# EAGLE design Switch-12v-PWM-4Ch (EAGLE 7.7.0)
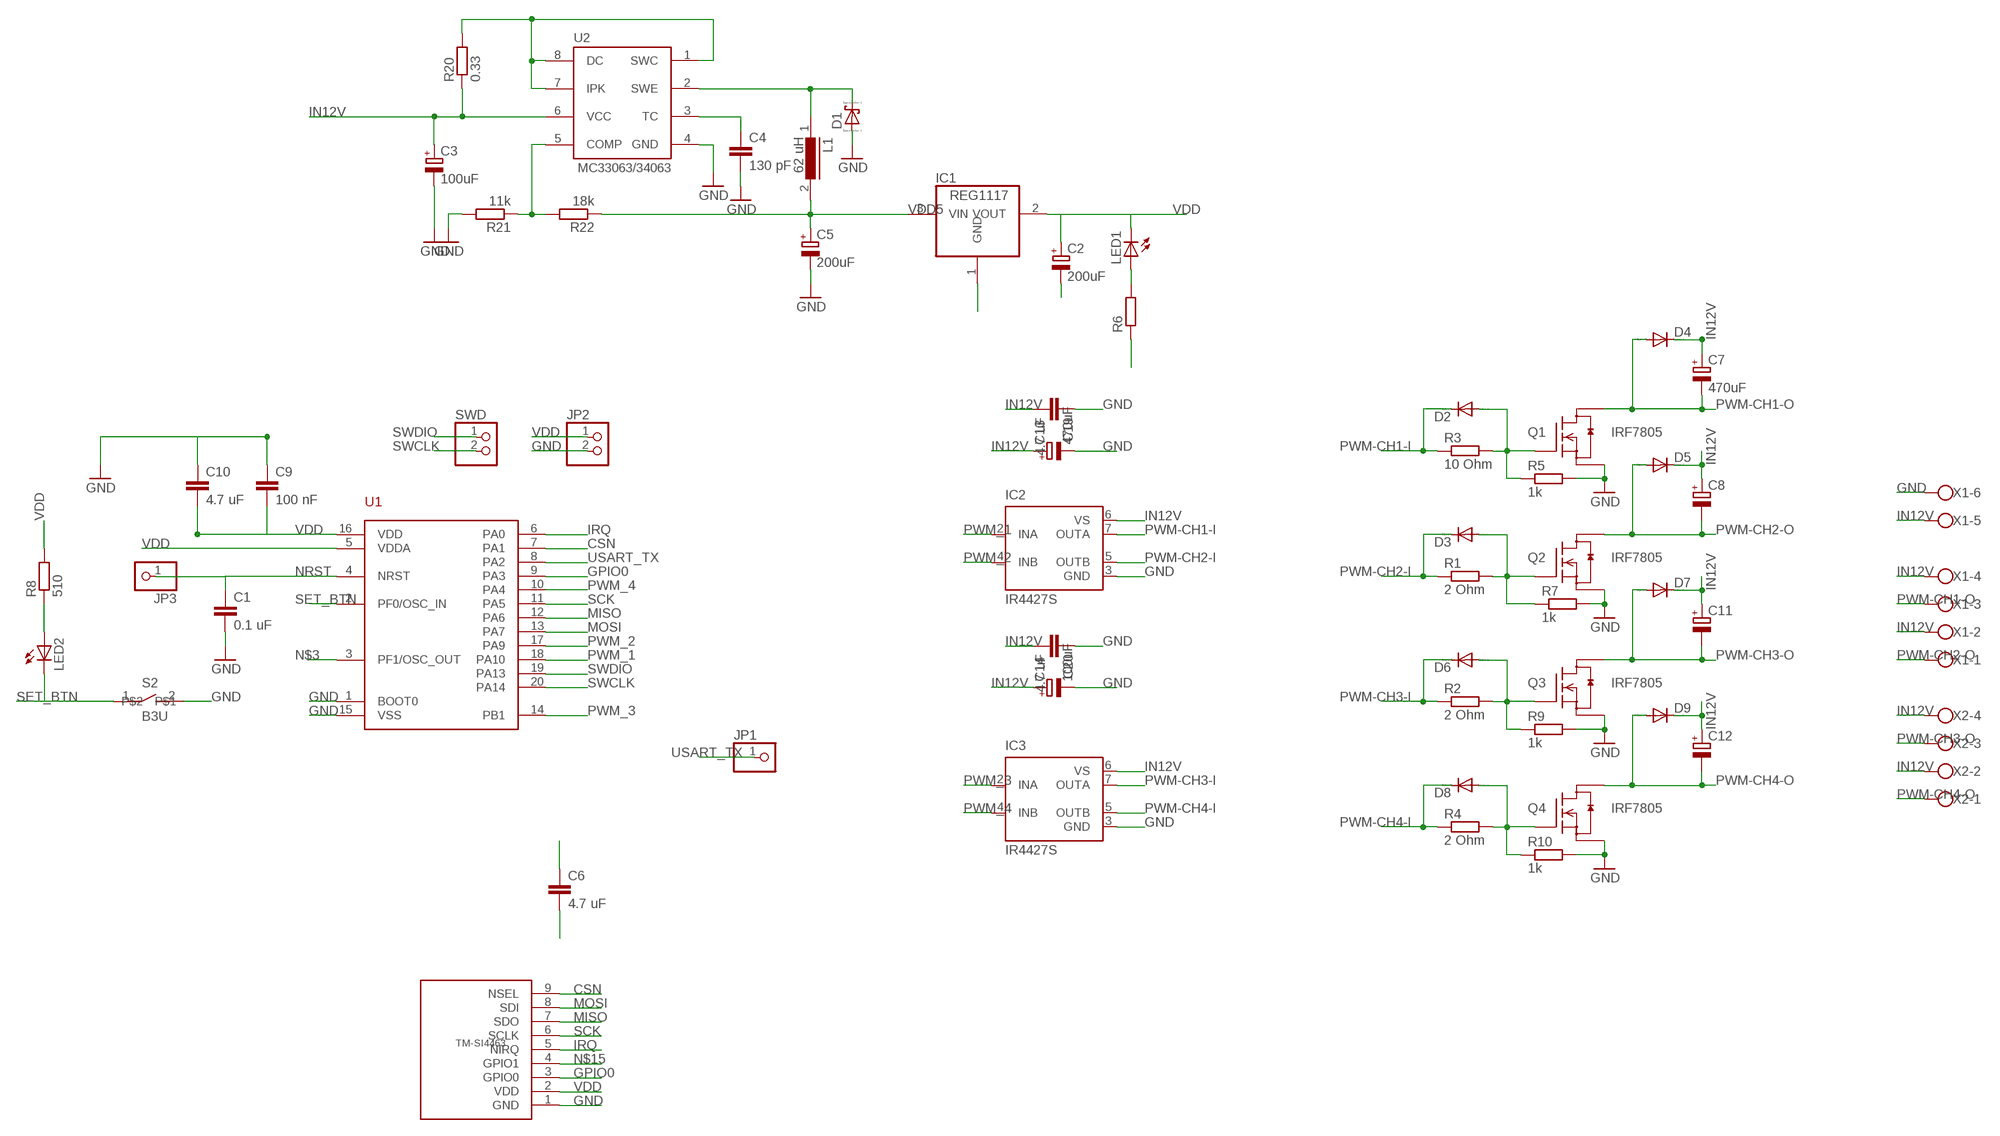
[diagram p0: schematic, sheet 1]

## Parts
C1  0.1 uF  C-EUC0805  [C0805]
C2  200uF  CPOL-EUSMCC  [SMC_C]
C3  100uF  CPOL-EUSMCC  [SMC_C]
C4  130 pF  C-EUC0805  [C0805]
C5  200uF  CPOL-EUSMCC  [SMC_C]
C6  4.7 uF  C-EUC0805  [C0805]
C7  470uF  CPOL-EUE5-8.5  [E5-8,5]
C8  CPOL-EUE5-8.5  [E5-8,5]
C9  100 nF  C-EUC0805  [C0805]
C10  4.7 uF  C-EUC0805  [C0805]
C11  CPOL-EUE5-8.5  [E5-8,5]
C12  CPOL-EUE5-8.5  [E5-8,5]
C13  470uF  CPOL-EU085CS-1AR  [085CS_1AR]
C14  100uF  CPOL-EU085CS-1AR  [085CS_1AR]
C19  4.7 uF  C-EUC0805  [C0805]
C20  4.7 uF  C-EUC0805  [C0805]
D1  SCHOTTKY-DIODE  [DIODE_SMB]
D2  DIODE-DO214BA  [DO214BA]
D3  DIODE-DO214BA  [DO214BA]
D4  DIODE-DO214BA  [DO214BA]
D5  DIODE-DO214BA  [DO214BA]
D6  DIODE-DO214BA  [DO214BA]
D7  DIODE-DO214BA  [DO214BA]
D8  DIODE-DO214BA  [DO214BA]
D9  DIODE-DO214BA  [DO214BA]
IC1  REG1117  [SOT223]
IC2  IR4427S  [SO08]
IC3  IR4427S  [SO08]
JP1  PINHD-1X1  [1X01]
JP2  PINHD-1X2  [1X02]
JP3  PINHD-1X1  [1X01]
L1  62 uH  DR73  [DR73]
LED1  LEDCHIPLED_0805  [CHIPLED_0805]
LED2  LEDCHIPLED_0805  [CHIPLED_0805]
Q1  IRF7805  [SO-8]
Q2  IRF7805  [SO-8]
Q3  IRF7805  [SO-8]
Q4  IRF7805  [SO-8]
R1  2 Ohm  R-EU_R0805  [R0805]
R2  2 Ohm  R-EU_R0805  [R0805]
R3  10 Ohm  R-EU_R0805  [R0805]
R4  2 Ohm  R-EU_R0805  [R0805]
R5  1k  R-EU_R0805  [R0805]
R6  R-EU_R0805  [R0805]
R7  1k  R-EU_R0805  [R0805]
R8  510  R-EU_R0805  [R0805]
R9  1k  R-EU_R0805  [R0805]
R10  1k  R-EU_R0805  [R0805]
R20  0.33  R-EU_R0805  [R0805]
R21  11k  R-EU_R0805  [R0805]
R22  18k  R-EU_R0805  [R0805]
S2  B3U  [1210]
SWD  PINHD-1X2  [1X02]
U1  STM32F030F4  [TSSOP20]
U2  MC33063/MC34063D  [SO08]
U$1  TM-SI4463  [TM-SI4463-SMD]
X1  W237-6  [W237-6]
X2  W237-4  [W237-4]

## Nets
CSN: U1.7(PA1) U$1.9(NSEL)
GND: C1.2 C2.- C3.- C4.2 C5.- C6.2 C9.1 C10.1 C13.- C14.- C19.1 C20.1 D1.A(C) IC1.1(GND) IC2.3(GND) IC3.3(GND) JP2.2 Q1.3(S) Q2.3(S) Q3.3(S) Q4.3(S) R5.2 R6.1 R7.2 R9.2 R10.2 R21.2 S2.2 U1.1(BOOT0) U1.15(VSS) U2.4(GND) U$1.1(GND) X1.6
GPIO0: U1.9(PA3) U$1.3(GPIO0)
IN12V: C3.+ C7.+ C8.+ C11.+ C12.+ C13.+ C14.+ C19.2 C20.2 D4.C D5.C D7.C D9.C IC2.6(VS) IC3.6(VS) R20.1 U2.6(VCC) X1.2 X1.4 X1.5 X2.2 X2.4
IRQ: U1.6(PA0) U$1.5(NIRQ)
MISO: U1.12(PA6) U$1.7(SDO)
MOSI: U1.13(PA7) U$1.8(SDI)
N$3: U1.3(PF1/OSC_OUT)
N$4: D2.A Q1.4(G) R3.2 R5.1
N$5: D3.A Q2.4(G) R1.2 R7.1
N$6: LED1.A R6.2
N$7: LED2.A R8.1
N$9: R21.1 R22.2 U2.5(COMP)
N$11: R20.2 U2.1(SWC) U2.7(IPK) U2.8(DC)
N$15: U$1.4(GPIO1)
N$18: C4.1 U2.3(TC)
N$19: D1.C(A) L1.1 U2.2(SWE)
N$26: D6.A Q3.4(G) R2.2 R9.1
N$29: D8.A Q4.4(G) R4.2 R10.1
NRST: C1.1 JP3.1 U1.4(NRST)
PWM-CH1-I: D2.C IC2.7(OUTA) R3.1
PWM-CH1-O: C7.- D4.A Q1.8(D) X1.3
PWM-CH2-I: D3.C IC2.5(OUTB) R1.1
PWM-CH2-O: C8.- D5.A Q2.8(D) X1.1
PWM-CH3-I: D6.C IC3.7(OUTA) R2.1
PWM-CH3-O: C11.- D7.A Q3.8(D) X2.3
PWM-CH4-I: D8.C IC3.5(OUTB) R4.1
PWM-CH4-O: C12.- D9.A Q4.8(D) X2.1
PWM_1: IC2.2(INA) U1.18(PA10)
PWM_2: IC2.4(INB) U1.17(PA9)
PWM_3: IC3.2(INA) U1.14(PB1)
PWM_4: IC3.4(INB) U1.10(PA4)
SCK: U1.11(PA5) U$1.6(SCLK)
SET_BTN: LED2.C S2.1 U1.2(PF0/OSC_IN)
SWCLK: SWD.2 U1.20(PA14)
SWDIO: SWD.1 U1.19(PA13)
USART_TX: JP1.1 U1.8(PA2)
VDD: C2.+ C6.1 C9.2 C10.2 IC1.2(VOUT) JP2.1 LED1.C R8.2 U1.5(VDDA) U1.16(VDD) U$1.2(VDD)
VDD5: C5.+ IC1.3(VIN) L1.2 R22.1
Unconnected: Q1.1(S) Q1.2(S) Q1.5(D) Q1.6(D) Q1.7(D) Q2.1(S) Q2.2(S) Q2.5(D) Q2.6(D) Q2.7(D) Q3.1(S) Q3.2(S) Q3.5(D) Q3.6(D) Q3.7(D) Q4.1(S) Q4.2(S) Q4.5(D) Q4.6(D) Q4.7(D)

## Library data of the parts
C1 C4 C6 C9 C10 C19 C20 = resistor:C-EU: CAPACITOR, European symbol
C2 C3 C5 C7 C8 C11-C14 = resistor:CPOL-EU: POLARIZED CAPACITOR, European symbol
D1 = eagle-ltspice:SCHOTTKY-DIODE: Schottky Diode; SPICEMODEL: NONE; SPICEPREFIX: D; SPICETYPE: diode
D2-D9 = diode:DIODE-: DIODE
IC1 = burr-brown:REG1117: 800mA and 1A Low Dropout (LDO) Positive Regulator 1.8V, 2.5V, 2.85V, 3.3V, 5V, and Adj; MPN: REG1117; OC_FARNELL: 1097566; OC_NEWARK: 14P6981
IC2 IC3 = ir:IR4427: DUAL LOW SIDE DRIVER Source: ID4426.pdf; MF: INTERNATIONAL RECTIFIER(IR); MPN: IR4427STRPBF; OC_FARNELL: 8639094; OC_NEWARK: 63J7933
JP1 JP3 = pinhead:PINHD-1X1: PIN HEADER
JP2 SWD = pinhead:PINHD-1X2: PIN HEADER
L1 = inductors:DR73: High Power Density, High Efficiency, Shielded Inductors Source: coiltronics_dr_series.pdf
LED1 LED2 = led:LED: LED OSRAM: - CHIPLED LG R971, LG N971, LY N971, LG Q971, LY Q971, LO R971, LY R971 LH N974, LH R974 LS Q976, LO Q976, LY Q976 LO Q996 - Hyper CHIPLED LW Q18S LB Q993, LB Q99A, LB R99A - SideLED LS A670, LO A670, LY A670, LG A670, LP A670 LB A673, LV A673, LT A673, LW A673 LH A674 LY A675 LS A676, LA A676, LO A676, LY A676, LW A676 LS A679, LY A679, LG A679 - Hyper Micro SIDELED® LS Y876, LA Y876, LO Y876, LY Y876 LT Y87S - SmartLED LW L88C, LW L88S LB L89C, LB L89S, LG L890 LS L89K, LO L89K, LY L89K LS L896, LA L896, LO L896, LY L896 - TOPLED LS T670, LO T670, LY T670, LG T670, LP T670 LSG T670, LSP T670, LSY T670, LOP T670, LYG T670 LG T671, LOG T671, LSG T671 LB T673, LV T673, LT T673, LW T673 LH T674 LS T676, LA T676, LO T676, LY T676, LB T676, LH T676, LSB T676, LW T676 LB T67C, LV T67C, LT T67C, LS T67K, LO T67K, LY T67K, LW E67C LS E67B, LA E67B, LO E67B, LY E67B, LB E67C, LV E67C, LT E67C LW T67C LS T679, LY T679, LG T679 LS T770, LO T770, LY T770, LG T770, LP T770 LB T773, LV T773, LT T773, LW T773 LH T774 LS E675, LA E675, LY E675, LS T675 LS T776, LA T776, LO T776, LY T776, LB T776 LHGB T686 LT T68C, LB T68C - Hyper Mini TOPLED® LB M676 - Mini TOPLED Santana® LG M470 LS M47K, LO M47K, LY M47K Source: http://www.osram.convergy.de LUXEON: - LUMILED® LXK2-PW12-R00, LXK2-PW12-S00, LXK2-PW14-U00, LXK2-PW14-V00 LXK2-PM12-R00, LXK2-PM12-S00, LXK2-PM14-U00 LXK2-PE12-Q00, LXK2-PE12-R00, LXK2-PE12-S00, LXK2-PE14-T00, LXK2-PE14-U00 LXK2-PB12-K00, LXK2-PB12-L00, LXK2-PB12-M00, LXK2-PB14-N00, LXK2-PB14-P00, LXK2-PB14-Q00 LXK2-PR12-L00, LXK2-PR12-M00, LXK2-PR14-Q00, LXK2-PR14-R00 LXK2-PD12-Q00, LXK2-PD12-R00, LXK2-PD12-S00 LXK2-PH12-R00, LXK2-PH12-S00 LXK2-PL12-P00, LXK2-PL12-Q00, LXK2-PL12-R00 Source: www.luxeon.com KINGBRIGHT: KA-3528ASYC Source: www.kingbright.com
Q1-Q4 = m-pad-2.1:IRF7805: Internation Rectifier's IRF7805 HEXFET® Chip-Set for DC-DC Converters Description: This new device employs advanced HEXFET Power MOSFET technology to achieve an unprecedented balance of on-resistance and gate charge. The reduced conduction and switching losses make this device ideal for high efficiency DC-DC Converters that power the latest generation of mobile microprocessors. The IRF7805 offers maximum efficiency for mobile CPU core DC-DC converters. N Channel Application Specific MOSFETs Ideal for Mobile DC-DC Converters Low Conduction Losses Low Switching Losses VDS = 30V RDS(on) = 11mOhm Qg = 31nC Please send any comments to: messi@users.sourceforge.net
R1-R10 R20-R22 = resistor:R-EU_: RESISTOR, European symbol
S2 = my_components:B3U
U1 = stm32f030f4:STM32F030F4
U2 = adafruit:MC33063/MC34063: MC33063 and MC34063 Basic DC/DC converter with internal power-NPN transistor, 100KHz, 1.5A peak switch current. 3-40 input/output.
U$1 = RemoteSwitchComponents:TM-SI4463
X1 = con-wago-500:W237-6: WAGO SCREW CLAMP; OC_FARNELL: unknown; OC_NEWARK: unknown
X2 = con-wago-500:W237-4: WAGO SCREW CLAMP; OC_FARNELL: unknown; OC_NEWARK: unknown

## Board
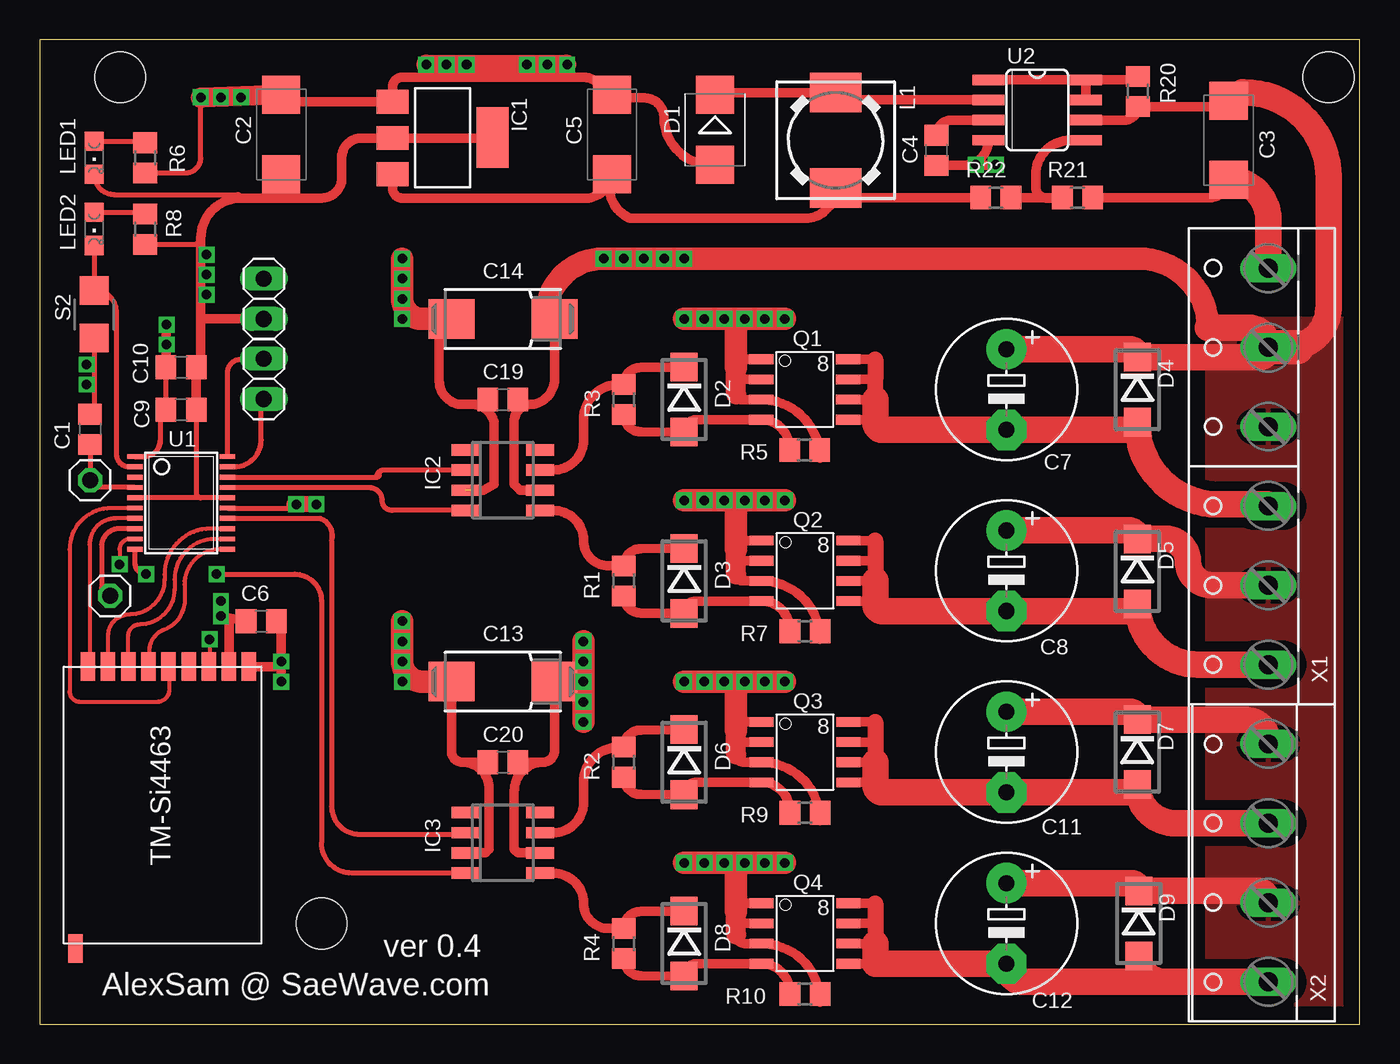
[diagram p1: board, top side]
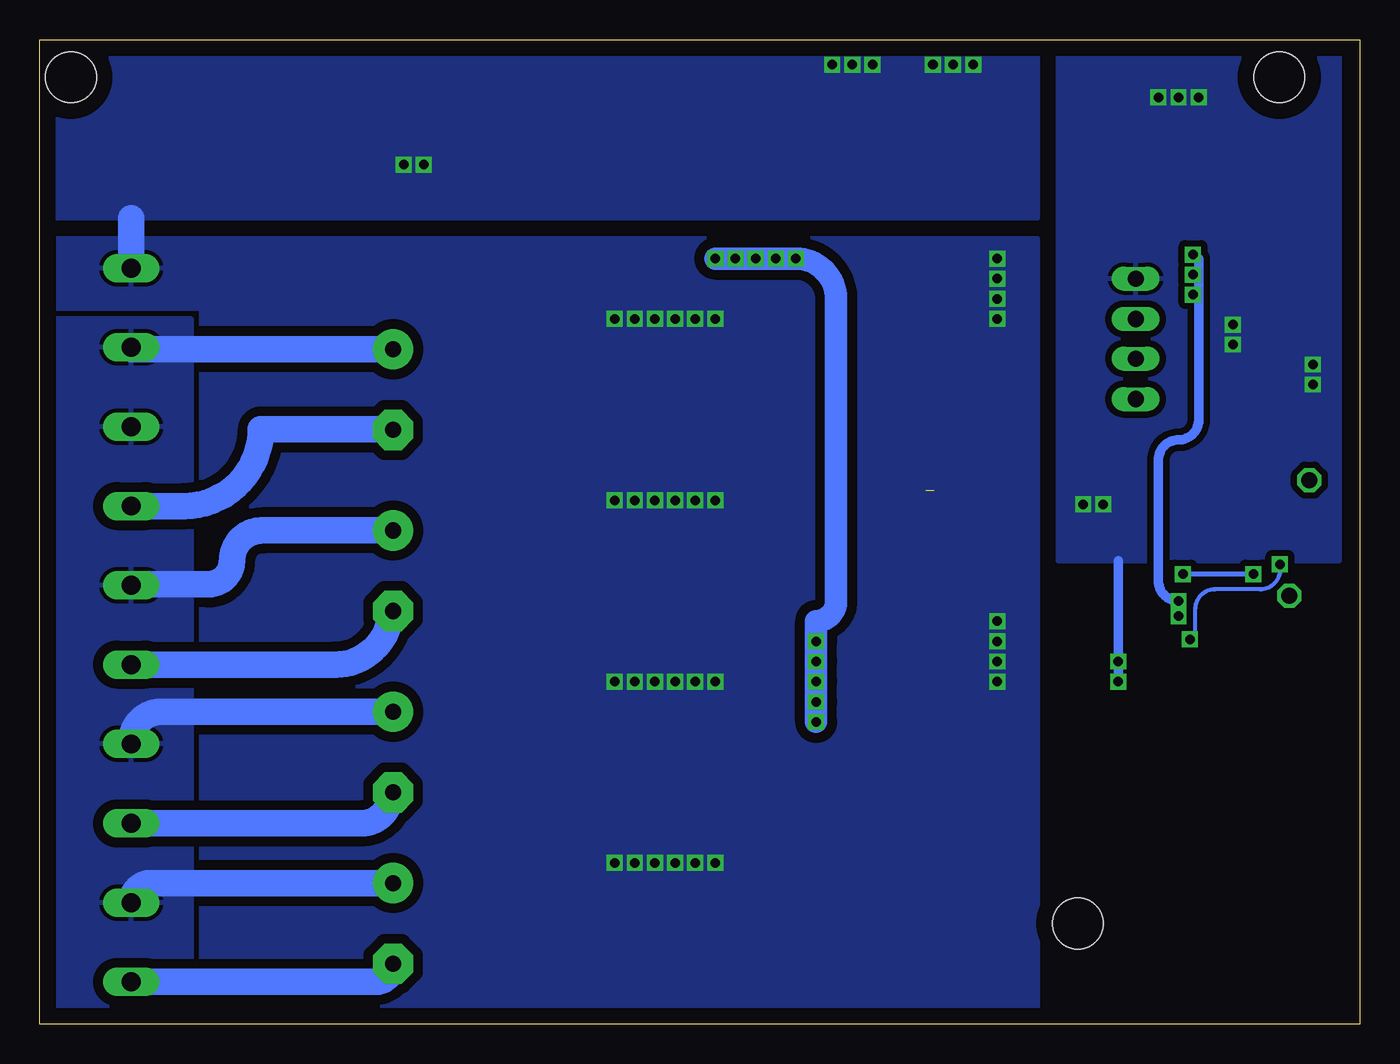
[diagram p2: board, bottom side, seen from below]

Size 83.25 x 62.05 mm. Coordinates in mm from the lower left corner, seen from the top.
Outline: 0,0 83.25,0 83.25,62.05 0,62.05 0,0
Copper layers (1*16): Top 0.035mm / dielectric 1.5mm / Bottom 0.035mm
Design rules "default *": minimum track width 10mil, minimum drill 12mil, track to track 8mil, track to pad 8mil, pad to pad 8mil, via to via 8mil, smd to smd 8mil, copper to edge 40mil, drill to drill 6mil, minimum pad ring 10mil, minimum via ring 8mil, stop-mask expansion 4mil, vias tented up to drill 24mil, thermal gap 10mil
Holes 3.2 mm at 5.08,59.69 81.28,59.69 17.78,6.35

### Footprints (pad centres in the part's own frame; a part is rotated, then mirrored left to right if it is on the bottom)
C0805 = smd 1.3 x 1.5: 1 -0.95,0; 2 0.95,0
SMC_C = smd 2.4 x 2.4: + -2.5,0; - 2.5,0
E5-8,5 = drill 1.016 pad 2.54: + -2.54,0 | drill 1.016 pad 2.54 octagon: - 2.54,0
085CS_1AR = smd 2.9 x 2.5: + 3.25,0; - -3.25,0
DIODE_SMB = smd 2.4 x 2.4: A 2.2,0; C -2.2,0
DO214BA = smd 1.8 x 1.7: A 2.05,0; C -2.05,0
SOT223 = smd 1.499 x 2.007: 1 -2.261,-3.15; 2 0.025,-3.15; 3 2.311,-3.15 | smd 3.81 x 2.007: 4 0,3.15
SO08 = smd 0.72 x 1.78: 1 -1.905,-2.35; 2 -0.635,-2.35; 3 0.635,-2.35; 4 1.905,-2.35; 5 1.905,2.35; 6 0.635,2.35; 7 -0.635,2.35; 8 -1.905,2.35
1X01 = drill 1.016 octagon: 1 0,0
1X02 = drill 1.016 long: 1 -1.27,0; 2 1.27,0
DR73 = smd 2.5 x 3.25: 1 -3,0; 2 3,0
CHIPLED_0805 = smd 1.2 x 1.2: A 0,-1.05; C 0,1.05
SO-8 = smd 1.524 x 0.61: 1 -2.743,1.27; 2 -2.743,0; 3 -2.743,-1.27; 4 -2.743,-2.54; 5 2.743,-2.54; 6 2.743,-1.27; 7 2.743,0; 8 2.743,1.27
R0805 = smd 1.3 x 1.5: 1 -0.95,0; 2 0.95,0
1210 = smd 1.8 x 1.8: 1 -1.499,0; 2 1.499,0
TSSOP20 = smd 0.305 x 0.991: 1 -2.925,-2.918; 2 -2.275,-2.918; 3 -1.625,-2.918; 4 -0.975,-2.918; 5 -0.325,-2.918; 6 0.325,-2.918; 7 0.975,-2.918; 8 1.625,-2.918; 9 2.275,-2.918; 10 2.925,-2.918; 11 2.925,2.918; 12 2.275,2.918; 13 1.625,2.918; 14 0.975,2.918; 15 0.325,2.918; 16 -0.325,2.918; 17 -0.975,2.918; 18 -1.625,2.918; 19 -2.275,2.918; 20 -2.925,2.918
SO08' = smd 0.66 x 2.032: 1 -1.905,-3.073; 2 -0.635,-3.073; 3 0.635,-3.073; 4 1.905,-3.073; 5 1.905,3.073; 6 0.635,3.073; 7 -0.635,3.073; 8 -1.905,3.073
TM-SI4463-SMD = smd 1.778 x 0.914: 1 8.572,-5.588; 2 8.572,-4.318; 3 8.572,-3.048; 4 8.572,-1.778; 5 8.572,-0.508; 6 8.572,0.762; 7 8.572,2.032; 8 8.572,3.302; 9 8.572,4.572; 10 -9.207,5.366
W237-6 = drill 1.194 long: 1 -12.5,-1.27; 2 -7.5,-1.27; 3 -2.5,-1.27; 4 2.5,-1.27; 5 7.5,-1.27; 6 12.5,-1.27
W237-4 = drill 1.194 long: 1 -7.5,-1.27; 2 -2.5,-1.27; 3 2.5,-1.27; 4 7.5,-1.27

### Placement (x,y rotation side)
C1  3.17,37.49 90 top
C2  15.24,56.08 90 top
C3  74.97,55.72 270 top
C4  56.55,55.08 270 top
C5  36.09,56.08 90 top
C6  13.97,25.4 0 top
C7  60.96,40 270 top
C8  60.96,28.58 270 top
C9  8.93,38.73 0 top
C10  8.93,41.41 0 top
C11  60.96,17.15 270 top
C12  60.96,6.35 270 top
C13  29.21,21.59 0 top
C14  29.21,44.45 0 top
C19  29.21,39.37 0 top
C20  29.21,16.51 0 top
D1  42.59,56.38 270 top
D2  40.64,39.37 270 top
D3  40.64,27.94 270 top
D4  69.22,39.99 270 top
D5  69.22,28.54 270 top
D6  40.64,16.51 270 top
D7  69.21,17.14 270 top
D8  40.64,5.08 270 top
D9  69.3,6.35 270 top
IC1  25.4,55.88 270 top
IC2  29.21,34.29 270 top
IC3  29.21,11.43 270 top
JP1  4.44,27 0 top
JP2  14.13,45.72 90 top
JP3  3.18,34.29 0 top
L1  50.19,55.72 270 top
LED1  3.44,54.61 180 top
LED2  3.44,50.13 180 top
Q1  48.24,40.64 0 top
Q2  48.26,29.21 0 top
Q3  48.26,17.78 0 top
Q4  48.26,6.35 0 top
R1  36.83,27.94 270 top
R2  36.83,16.51 270 top
R3  36.83,39.37 270 top
R4  36.83,5.08 270 top
R5  48.24,36.19 0 top
R6  6.66,54.61 90 top
R7  48.26,24.76 0 top
R8  6.66,50.1 270 top
R9  48.26,13.33 0 top
R10  48.26,1.9 0 top
R20  69.25,58.79 90 top
R21  65.44,52.1 0 top
R22  60.29,52.1 0 top
S2  3.44,44.76 270 top
SWD  14.13,40.67 90 top
U1  8.93,32.85 270 top
U2  MC33063/MC34063D  [SO08']  62.9,57.62 270 top
U$1  7.62,13.97 90 top
X1  76.2,35.16 90 top
X2  76.2,10.16 90 top

### Tracks (layer width: path | path; a pad name or v marks a point on that pad's centre or on a via)
CSN
  Top 0.254: U1.7 4.79,31.88 arc90 3.15,30.24 3.15,22.64 arc-90 U$1.9
GND  (via drill 0.6)  (1 unrouted)
  Top 0.305: U1.1 6.57,35.78 arc90 7.62,36.83 7.62,38.38 arc-90 C9.1 C10.1 | S2.2 3.44,41.91 | 3.44,41.91 3.44,40.64 | 3.44,40.64 3.44,38.71 arc-90 C1.2 | v2.96,41.58 3.11,41.58 arc90 3.44,41.91 | v2.96,40.32 3.12,40.32 arc90 3.44,40.64 | U1.15 17.22,32.53 arc90 v17.45,32.76 | R6.1 9.21,53.66 arc90 10.16,54.61 v10.16,58.42
  Top 0.61: 43.91,5.66 arc90 44.49,5.08 Q4.3 arc-90 49.21,1.39 R10.2 | 43.91,7.08 arc-90 44.45,7.62 45.72,7.62 | 43.91,6.35 45.72,6.35 | 43.91,17 arc90 44.4,16.51 Q3.3 arc-90 49.21,12.82 R9.2 | 43.91,18.51 arc-90 44.45,19.05 45.72,19.05 | 43.91,28.34 arc90 44.31,27.94 Q2.3 arc-90 49.21,24.25 R7.2 | 43.91,29.94 arc-90 44.45,30.48 45.72,30.48 | 43.91,29.21 45.72,29.21 | 43.91,17.78 45.72,17.78 | 43.91,41.37 arc-90 44.45,41.91 45.72,41.91 | 45.72,40.64 43.91,40.64 43.91,39.68 arc90 44.22,39.37 Q1.3 arc-90 49.19,35.68 R5.2 | U2.4 arc-90 58.24,54.13 C4.2 60.24,54.13 arc90 v60.29,54.18 | R21.2 73.65,52.1 arc90 C3.- | D1.A 42.34,54.18 arc-90 39.37,57.15 arc90 38.14,58.38 35.56,58.38 | 35.56,58.38 C5.- | 33.02,59.69 22.86,59.69 arc90 22.25,59.08 IC1.1 15.48,58.14 arc-90 C2.- | 33.02,59.69 34.29,59.69 arc-90 35.56,58.42 35.56,58.38 | C6.2 arc-90 15.24,25.08 v15.24,22.86 | v15.24,22.86 v15.24,21.59 | C10.1 7.97,44.08 arc-90 v8,44.1 | v33.27,60.48 33.02,59.69 | 27.09,39.06 arc-90 28.66,37.8 28.66,34.02 27.98,33.66 27.36,33.66 | 27.09,39.06 26.67,39.06 | 26.67,39.06 26.46,39.06 | 25.4,44.45 arc90 25.2,44.25 25.2,40.53 arc90 26.67,39.06 | C19.1 27.95,39.06 27.09,39.06 | IC3.3 28.11,10.79 28.35,11.04 28.35,14.83 arc90 26.67,16.51 | C20.1 26.67,16.51 | C13.- 25.96,17.22 arc90 26.67,16.51 | U$1.1 14.92,22.54 arc90 v15.24,22.86
  Top 1.016: v17.45,32.76 16.07,32.76
  Top 1.27: 43.91,7.08 43.91,6.35 43.91,5.66 | 43.91,18.51 43.91,17.78 43.91,17 | 43.91,29.94 43.91,29.21 43.91,28.34 | 43.91,39.68 43.91,41.37 | C2.- 10.2,58.38 arc-90 v10.16,58.42 | v24.38,60.48 33.2,60.48
  Top 1.422: 43.91,7.08 43.91,10.16 | 43.91,10.16 v43.18,10.16 v41.91,10.16 v40.64,10.16 | 43.91,10.16 v44.45,10.16 v45.72,10.16 v46.99,10.16 | 43.91,29.94 43.91,33.02 | 43.91,33.02 v43.18,33.02 v41.91,33.02 v40.64,33.02 | 43.91,33.02 v44.45,33.02 v45.72,33.02 v46.99,33.02 | 43.91,18.51 43.91,21.59 | 43.91,21.59 v43.18,21.59 v41.91,21.59 v40.64,21.59 | 43.91,21.59 v44.45,21.59 v45.72,21.59 v46.99,21.59 | 43.91,41.37 43.91,44.45 | 43.91,44.45 v43.18,44.45 v41.91,44.45 v40.64,44.45 | 43.91,44.45 v44.45,44.45 v45.72,44.45 v46.99,44.45 | C14.- 25.4,44.45 24.13,44.45 arc-90 v22.86,45.72 v22.86,46.99 v22.86,48.26 | C13.- 24.13,21.59 arc-90 v22.86,22.86 v22.86,24.13 v22.86,25.4
  Top 1.676: X1.6 77.47,50.77 arc90 C3.-
  Bottom 0.61: v15.24,21.59 15.24,29.21
  Bottom 1.676: X1.6 77.47,50.8
  other vias: 22.86,44.45 59.03,54.18 22.86,21.59 11.43,58.42 12.7,58.42 25.65,60.48 26.92,60.48 32,60.48 30.73,60.48 8,42.84 16.18,32.76
  pour Bottom (isolate 0.61): 82.55,49.53 20.32,49.53 20.32,0 73.03,0 73.03,45.08 82.55,45.08
  pour Bottom (isolate 0.406): 19.05,63.5 19.05,29.21 1.27,29.21 1.27,63.5
  pour Bottom (isolate 0.406): 20.32,50.8 83.82,50.8 83.82,62.23 20.32,62.23
GPIO0  (via drill 0.6)
  Top 0.254: U1.9 5.7,30.58 arc90 5.04,29.93 v5.04,28.98 | v10.71,24.25 10.71,22.58 arc-90 U$1.3
  Bottom 0.254: v5.04,28.98 5.04,28.66 arc90 6.3,27.41 9.13,27.41 arc-90 10.39,26.14 10.39,24.57 arc90 v10.71,24.25
IN12V  (via drill 0.6)
  Top 0.61: C3.+ arc-90 73.99,57.84 R20.1 arc-90 68.39,56.98 U2.6 | 30.87,39.06 arc90 29.93,37.8 29.93,34.02 30.29,33.66 IC2.6 | C14.+ 32.46,40.65 arc-90 30.87,39.06 | C19.2 30.47,39.06 30.87,39.06 | IC3.6 30.16,10.79 29.93,11.04 29.93,14.69 arc-90 31.75,16.51 | C20.2 31.75,16.51 | C13.+ 32.46,17.22 arc-90 31.75,16.51
  Top 1.422: 73.66,43.89 arc90 69.29,48.26 v40.64,48.26 v39.37,48.26 v38.1,48.26 v36.83,48.26 v35.56,48.26 arc90 31.91,44.61 C14.+ | C13.+ v34.29,21.59 | v34.29,21.59 v34.29,22.86 v34.29,24.13 | v34.29,21.59 v34.29,20.32 v34.29,19.05
  Top 1.676: 73.66,43.89 76.24,43.89 arc-90 X1.5 arc-90 76.85,42.04 D4.C arc90 68.72,42.54 C7.+ | C3.+ 75.88,58.74 arc-90 81.28,53.34 81.28,45.2 arc-90 78.74,42.66 | X2.2 arc90 76.73,8.4 D9.C arc90 68.81,8.89 C12.+ | C11.+ 68.72,19.69 arc-90 D7.C 75.94,19.2 arc-90 X2.4 | X1.2 73.94,27.66 arc-90 72.39,29.21 arc90 71.01,30.59 D5.C arc90 68.69,31.12 C8.+
  Top 2.184: X1.5 78.74,42.66 79.26,42.66
  Bottom 1.422: v40.64,48.26 v39.37,48.26 v38.1,48.26 v36.83,48.26 v35.56,48.26 arc90 33.02,45.72 33.02,26.67 arc90 34.29,25.4 v34.29,24.13 v34.29,22.86 v34.29,21.59 v34.29,20.32 v34.29,19.05
  Bottom 1.676: C7.+ 77.35,42.54 arc90 X1.5 | C8.+ 69.21,31.12 arc-90 71.12,29.21 arc90 72.61,27.72 77.49,27.72 | C11.+ 75.56,19.69 arc-90 77.47,17.78 | C12.+ 76.2,8.89 arc-90 77.47,7.62
  pour Bottom (isolate 0.61): 73.66,44.45 82.55,44.45 82.55,0 73.66,0
  pour Top (isolate 0.61): 73.66,44.45 82.55,44.45 82.55,1.27 73.66,1.27
IRQ
  Top 0.254: U1.6 4.5,32.53 arc90 1.89,29.93 1.89,20.97 arc90 2.54,20.32 7.41,20.32 arc90 8.19,21.11 8.19,22.48 arc90 U$1.5
MISO
  Top 0.254: U1.12 11.05,30.58 arc90 8.51,28.04 8.51,27.41 arc-90 6.3,25.2 arc90 5.59,24.49 U$1.7
MOSI
  Top 0.254: U1.13 10.76,31.23 arc90 7.88,28.35 7.88,28.04 arc-90 5.67,25.83 arc90 4.32,24.48 U$1.8
N$4
  Top 0.61: R3.2 arc90 37.91,37.34 D2.A arc-90 41.4,38.1 Q1.4 arc-90 47.29,36.31 R5.1
N$5
  Top 0.61: R7.1 47.31,24.88 arc90 Q2.4 41.4,26.67 arc90 D3.A 37.91,25.91 arc-90 R1.2
N$6
  Top 0.305: LED1.A 6.56,55.66 arc-90 R6.2
N$7
  Top 0.305: LED2.A 6.54,51.18 arc-90 R8.1
N$9
  Top 0.61: R22.2 R21.1 arc-90 64.46,52.07 63.5,52.07 arc-90 62.81,52.76 62.81,53.55 arc-90 64.97,55.72 U2.5
N$11
  Top 0.61: U2.8 69.03,59.52 arc90 R20.2 | U2.7 U2.8 | U2.8 U2.1
N$18
  Top 0.61: U2.3 57.51,56.98 arc90 C4.1
N$19
  Top 0.61: U2.2 50.65,58.26 arc-90 L1.1 42.72,58.72 arc90 D1.C
N$26
  Top 0.61: R2.2 arc90 37.91,14.48 D6.A arc-90 41.4,15.24 Q3.4 arc-90 47.31,13.45 R9.1
N$29
  Top 0.61: R10.1 47.31,2.02 arc90 Q4.4 41.4,3.81 arc90 D8.A 37.91,3.06 arc-90 R4.2
NRST
  Top 0.305: U1.4 3.64,33.83 arc-90 JP3.1 arc-90 JP3.1 C1.1
PWM-CH1-I
  Top 0.61: D2.C 37.91,41.4 arc90 R3.1 36.51,40.32 arc90 34.29,38.1 34.29,36.83 arc-90 32.38,34.92 IC2.7
PWM-CH1-O
  Top 0.61: Q1.8 52.7,41.91 | 52.7,38.1 50.8,38.1 | 52.7,40.64 50.8,40.64 | 52.7,39.37 50.8,39.37
  Top 1.016: 52.7,38.1 52.7,39.37 52.7,40.64 52.7,41.91
  Top 1.676: 52.7,39.37 52.7,37.94 arc90 53.18,37.46 C7.- 68.74,37.46 arc90 D4.A 69.22,37.88 arc90 74.34,32.76 77.37,32.76 arc-90 X1.3
  Bottom 1.676: X1.3 74.12,32.66 arc-90 69.3,37.48 61.11,37.48
PWM-CH2-I
  Top 0.61: D3.C 37.91,29.96 arc90 R1.1 35.88,28.89 arc-90 34.29,30.48 arc90 32.38,32.38 IC2.5
PWM-CH2-O
  Top 0.61: Q2.8 52.7,30.48 | 52.7,26.67 50.8,26.67 | 52.7,29.21 50.8,29.21 | 52.7,27.94 50.8,27.94
  Top 1.016: 52.7,26.67 52.7,27.94 52.7,29.21 52.7,30.48
  Top 1.676: 52.7,27.94 52.7,26.49 arc90 53.15,26.04 C8.- 68.77,26.04 arc90 D5.A arc90 73.05,22.66 X1.1
  Bottom 1.676: X1.1 64.59,22.66 arc-90 61.11,26.14
PWM-CH3-I
  Top 0.61: D6.C 37.91,18.54 arc90 R2.1 36.51,17.46 arc90 34.29,15.24 34.29,13.97 arc-90 32.38,12.06 IC3.7
PWM-CH3-O
  Top 0.61: Q3.8 52.7,19.05 | 52.7,15.24 50.8,15.24 | 52.7,17.78 50.8,17.78 | 52.7,16.51 50.8,16.51
  Top 1.016: 52.7,15.24 52.7,16.51 52.7,17.78 52.7,19.05
  Top 1.676: 52.7,16.51 52.7,15.1 arc90 53.19,14.61 C11.- 68.72,14.61 arc90 D7.A arc90 71.64,12.66 X2.3
  Bottom 1.676: X2.3 62.94,12.66 arc-90 61.11,14.49
PWM-CH4-I
  Top 0.61: D8.C 37.91,7.11 arc90 R4.1 35.88,6.03 arc-90 34.29,7.62 arc90 32.38,9.53 IC3.5
PWM-CH4-O
  Top 0.61: Q4.8 52.7,7.62 | 52.7,3.81 50.8,3.81 | 52.7,6.35 50.8,6.35 | 52.7,5.08 50.8,5.08
  Top 1.016: 52.7,3.81 52.7,5.08 52.7,6.35 52.7,7.62
  Top 1.676: 52.7,4.3 52.7,5.08 | D9.A arc90 70.94,2.66 | 70.94,2.66 X2.1 | 70.94,2.66 62.11,2.66 arc-90 C12.- 52.7,3.81
  Bottom 1.676: X2.1 62.11,2.66 arc-90 C12.-
PWM_1
  Top 0.305: U1.18 21.25,34.48 | 21.25,34.48 arc90 21.42,34.65 | IC2.2 21.7,34.92 arc90 21.25,34.48
PWM_2
  Top 0.305: U1.17 20.78,33.83 arc-90 21.59,33.02 arc90 22.23,32.38 IC2.4
PWM_3
  Top 0.305: U1.14 17.65,31.88 arc-90 18.41,30.48 18.41,13.73 arc90 20.17,11.97 26.77,11.97 arc90 IC3.2
PWM_4  (via drill 0.6)
  Top 0.305: U1.10 6.01,29.06 arc90 v6.71,28.36 | v11.15,28.36 16.09,28.36 arc-90 17.77,26.67 17.77,11.43 arc90 19.68,9.53 IC3.4
  Bottom 0.305: v6.71,28.36 v11.15,28.36
SCK
  Top 0.254: U1.11 11.35,29.93 arc90 9.13,27.72 9.13,26.46 arc-63 7.88,24.89 arc66 6.93,23.62 U$1.6
SET_BTN
  Top 0.305: U1.2 5.63,35.13 arc-90 4.85,35.91 4.85,44.84 arc90 S2.1 LED2.C
SWCLK
  Top 0.305: U1.20 11.84,41.05 arc-90 12.7,41.91 14.1,41.91 arc90 SWD.2
SWDIO
  Top 0.305: U1.19 12.27,35.13 arc90 13.97,36.83 13.97,39.24 arc-90 SWD.1
USART_TX
  Top 0.305: U1.8 5.21,31.23 arc90 3.9,30.24 3.9,27.53 arc90 JP1.1
VDD  (via drill 0.6)
  Top 0.305: U1.16 10.16,33.18 | 10.16,33.18 U1.5 | C9.2 9.88,33.47 arc90 10.16,33.18 | R8.2 9.79,49.16 arc90 10.16,49.53 | LED1.C arc90 4.71,52.29 12.48,52.29 arc-90 12.7,52.07 | v10.52,45.99 10.43,45.99 arc90 10.16,45.72
  Top 0.61: 16.15,52.07 17.78,52.07 arc90 19.05,53.34 19.05,54.61 arc-90 20.3,55.85 IC1.2 28.57,55.85 arc90 28.79,56.07 | 16.15,52.07 arc-90 C2.+ | 16.15,52.07 12.7,52.07 arc90 10.16,49.53 10.16,45.72 10.16,44.45 | 10.16,44.45 10.16,41.7 arc-90 C10.2 C9.2 | JP2.1 10.16,44.45 | C6.1 v11.43,25.71 | v11.43,25.71 v11.43,26.67 | U$1.2 11.94,24.89 arc90 v11.43,25.71
  Bottom 0.61: v11.43,25.71 v11.43,26.67 arc90 12.7,27.94 12.7,35.56 arc90 11.43,36.83 arc-90 10.16,38.1 10.16,45.72 | 10.16,45.72 10.16,46.99 | 10.16,46.99 10.16,48.26 10.27,48.26 arc90 v10.52,48.51 | v10.52,45.99 arc-90 10.25,45.72 10.16,45.72 | v10.52,47.25 arc-90 10.26,46.99 10.16,46.99
VDD5
  Top 0.61: R22.1 50.8,52.1 arc-90 L1.2 arc-90 48.27,50.8 37.21,50.8 arc-90 C5.+ arc-90 34.12,52.07 22.86,52.07 arc-90 22.25,52.68 IC1.3

### Text on the board
tNames: ver 0.4 | AlexSam @ SaeWave.com
tValues: GND | VDD3.3 | SWCLK | SWDIO | nRST | USART